# EasyEDA Pro project CH32V307_V3.0.0.eprj, board CH32V307
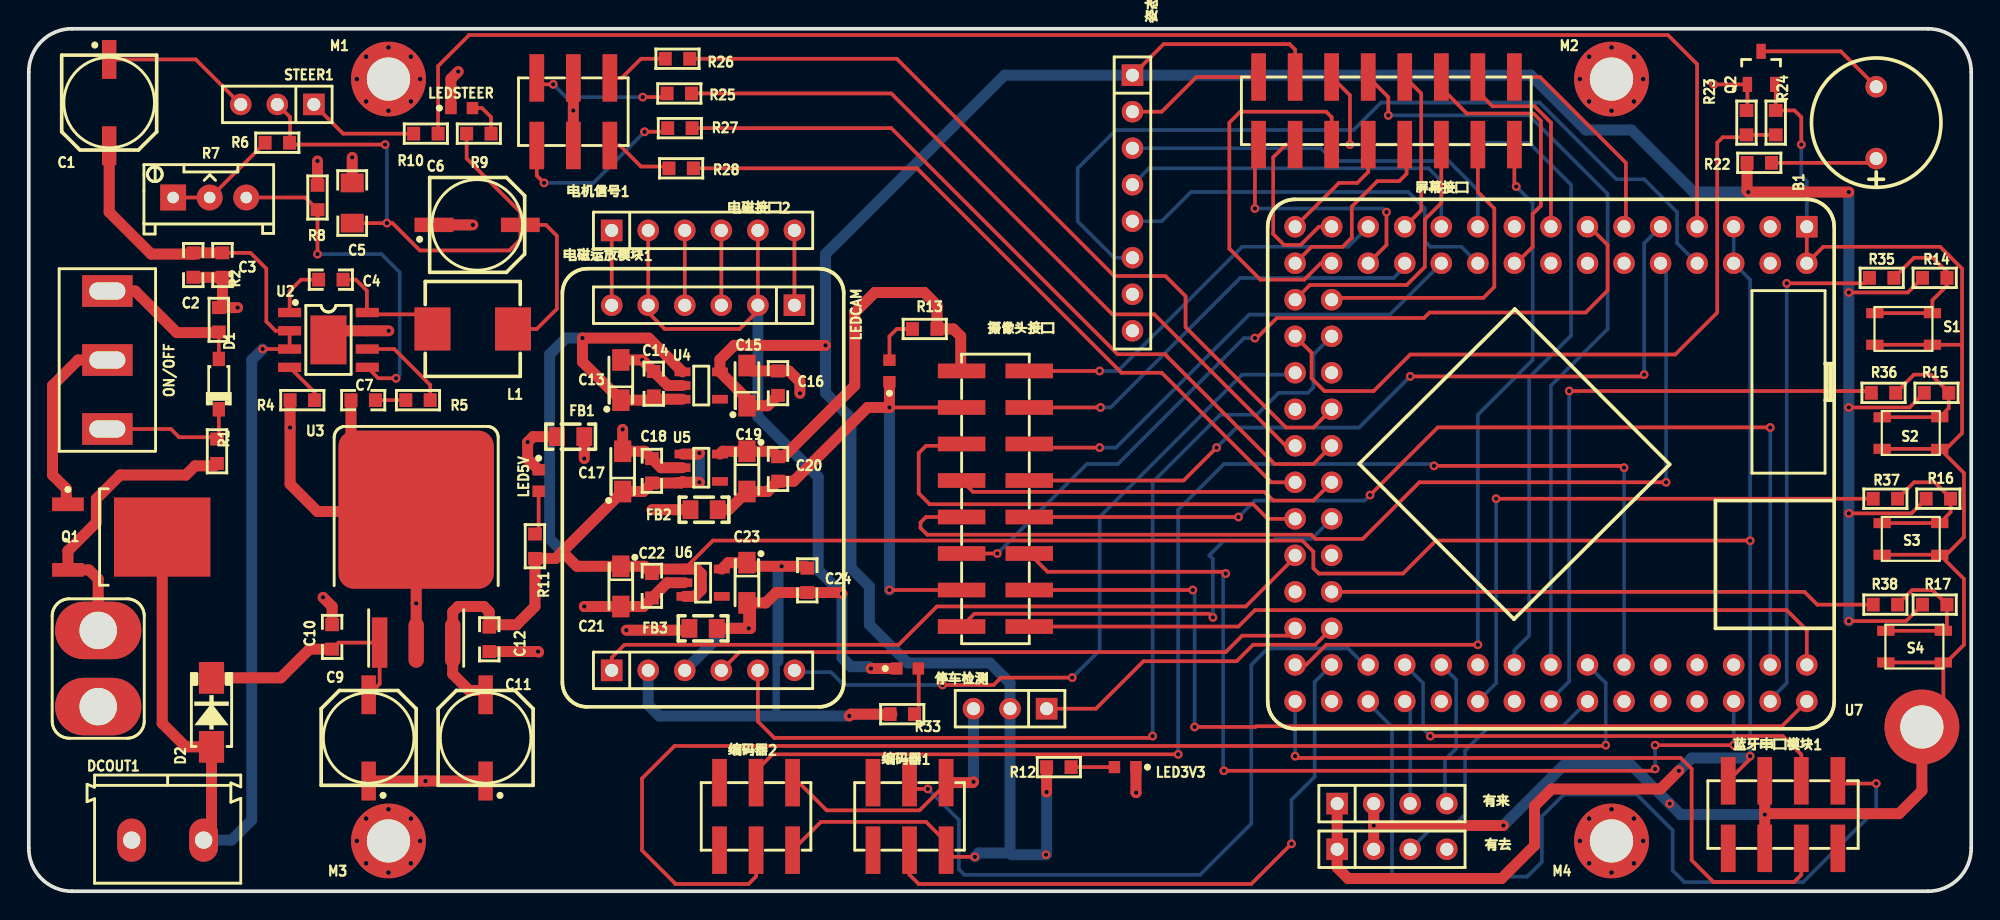
[diagram p1: board, top side]
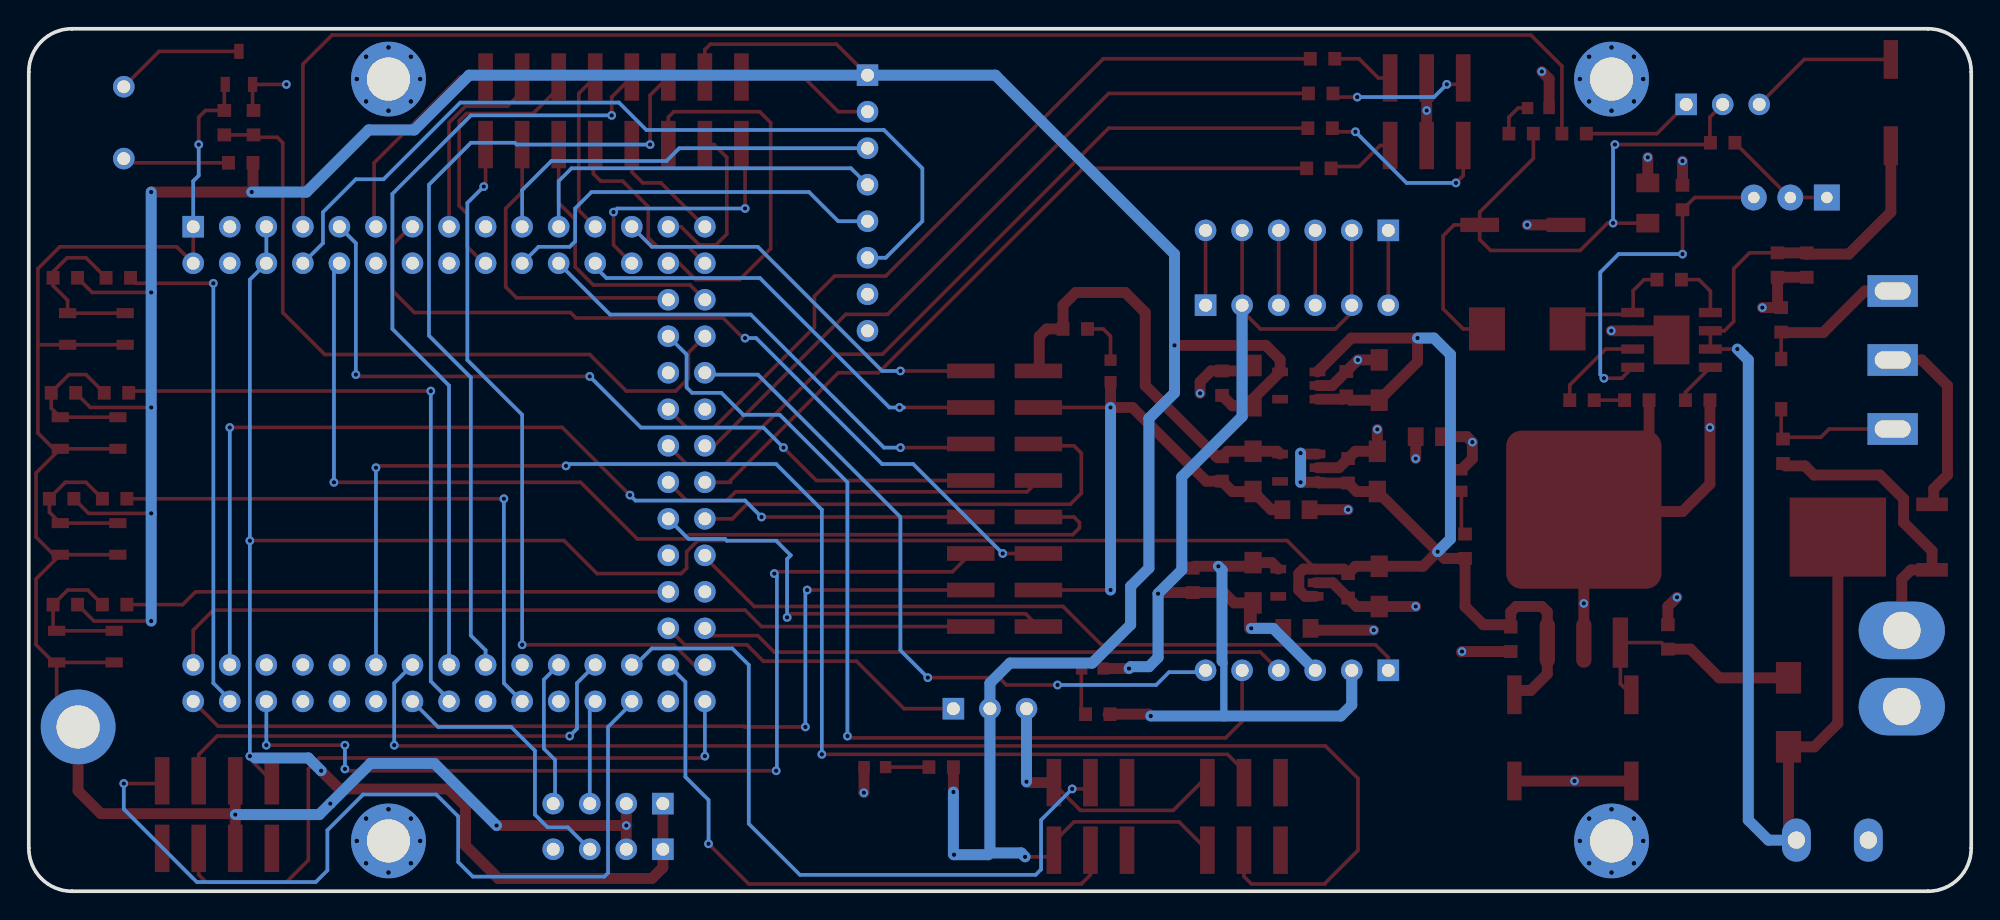
[diagram p2: board, bottom side, seen from below]

Outline 135 x 60 mm; copper layers: Top Layer, Bottom Layer. Coordinates in mm from the lower left corner of the outline.
Outline path: 0,57 0,3 arc(0.88,0.88) 3,0 132,0 arc(134.12,0.88) 135,3 135,57 arc(134.12,59.12) 132,60 3,60 arc(0.88,59.12) 0,57
Stack: Top Layer 0.035mm / Dielectric1 1.51mm FR4 er 4.5 / Bottom Layer 0.035mm

## Design rules (mm)
spacing safeClearance (default): track to track 0.152, other pairs 0.152 to 0.3
track width trackWidth (default): min 0.127, default 0.254, max 2.54
differential pair differentialPair (default): width min 0.127, default 0.254, max 2.54; gap min 0.152, default 0.152
via viaSize (default): diameter min 0.5, default 0.61, max 10; hole min 0.3, default 0.305, max 6

## Placement (name value [footprint] x y rotation side)
B1  BEEP  [BEEP 9x5.5mm]  128.4 53.47 90 top
C1  220uF  [CAPS6.3]  5.59 54.86 90 top
C2  4.7nF  [CAPC1608[0603]S-N]  11.43 43.56 270 top
C3  100nF  [CAPC1608[0603]S-N]  13.46 43.56 270 top
C4  100nF  [CAPC1608[0603]S-N]  20.99 42.55 0 top
C5  47uF  [CAPC3216[1206]S]  22.48 47.88 90 top
C6  220uF  [CAPS6.3]  31.16 46.36 180 top
C7  4.7nF  [CAPC1608[0603]S-N]  23.24 34.16 180 top
C9  100uF  [CAPS6.3]  23.62 10.67 270 top
C10  100nF  [CAPC1608[0603]S-N]  21.08 17.69 90 top
C11  220uF  [CAPS6.3]  31.75 10.67 270 top
C12  100nF  [CAPC1608[0603]S-N]  32 17.53 270 top
C13  10uF  [CAPT3216]  41.15 35.56 90 top
C14  100nF  [CAPC1608[0603]S-N]  43.43 35.31 90 top
C15  10uF  [CAPT3216]  49.91 35.18 90 top
C16  100nF  [CAPC1608[0603]S-N]  52.07 35.34 90 top
C17  10uF  [CAPT3216]  41.28 29.21 90 top
C18  100nF  [CAPC1608[0603]S-N]  43.31 29.25 90 top
C19  10uF  [CAPT3216]  49.91 29.21 270 top
C20  100nF  [CAPC1608[0603]S-N]  52.07 29.38 270 top
C21  10uF  [CAPT3216]  41.15 21.21 270 top
C22  100nF  [CAPC1608[0603]S-N]  43.31 21.25 270 top
C23  10uF  [CAPT3216]  49.91 21.46 270 top
C24  100nF  [CAPC1608[0603]S-N]  54.1 21.63 270 top
D1  BZT52C16  [SOD-123-L]  13.21 35.28 270 top
D2  SS54  [SMA[DO-214AC]]  12.7 12.45 90 top
DCOUT1  KF/WJ/DG 30x connecter  [KF/WJ/DG 301-2p-5.0mm]  9.65 3.56 0 top
FB1  0R  [INDC2012[0805]S]  37.66 31.62 0 top
FB2  0R  [INDC2012[0805]S]  46.93 26.54 0 top
FB3  0R  [INDC2012[0805]S]  46.86 18.29 0 top
L1  4.7uH  [0630 TPC 7*7*3]  30.86 39.12 0 top
LED3V3  翠绿贴片LED  [LEDC1608(0603)]  76.2 8.64 180 top
LED5V  翠绿贴片LED  [LEDC1608(0603)]  35.43 28.58 270 top
LEDCAM  翠绿贴片LED  [LEDC1608(0603)]  59.82 36.19 90 top
LEDOP  翠绿贴片LED  [LEDC1608(0603)]  61.07 15.49 0 top
LEDSTEER  翠绿贴片LED  [LEDC1608(0603)]  30.09 54.48 0 top
M1  MountHole  [M3-MountHole-Plated]  25 56.5 0 top
M2  MountHole  [M3-MountHole-Plated]  110 56.5 0 top
M3  MountHole  [M3-MountHole-Plated]  25 3.5 0 top
M4  MountHole  [M3-MountHole-Plated]  110 3.5 0 top
NOREF  -  [Pad_e1205]  131.57 11.43 0 top
ON/OFF  SW-SPDT  [SS12D10]  5.46 36.96 90 top
Q1  HY19P03  [TO-252AA]  6 24.64 0 top
Q2  S8050  [SOT-23]  120.4 57.28 90 top
R1  4.7K  [RESC1608[0603]S-N]  13.08 30.61 90 top
R2  1K  [RESC1608[0603]S-N]  13.21 39.75 270 top
R4  200K  [RESC1608[0603]S-N]  19.01 34.16 180 top
R5  20K  [RESC1608[0603]S-N]  27.05 34.16 180 top
R6  15K  [RESC1608[0603]S-N]  17.27 52.07 180 top
R7  10K  [RESPOT3296]  12.57 48.26 0 top
R8  3.3K  [RESC1608[0603]S-N]  20.07 48.26 90 top
R9  10K  [RESC1608[0603]S-N]  31.28 52.7 180 top
R10  1K  [RESC1608[0603]S-N]  27.6 52.7 0 top
R11  4.7K  [RESC1608[0603]S-N]  35.18 24 90 top
R12  2.7K  [RESC1608[0603]S-N]  71.59 8.64 0 top
R13  2.7K  [RESC1608[0603]S-N]  62.27 39.12 180 top
R14  4.7K(DNP)  [RESC1608[0603]S-N]  132.46 42.67 0 top
R15  4.7K(DNP)  [RESC1608[0603]S-N]  132.59 34.67 0 top
R16  4.7K(DNP)  [RESC1608[0603]S-N]  132.72 27.3 0 top
R17  4.7K(DNP)  [RESC1608[0603]S-N]  132.46 19.94 0 top
R22  10R  [RESC1608[0603]S-N]  120.27 50.67 0 top
R23  4.7K  [RESC1608[0603]S-N]  119.38 53.47 90 top
R24  10K  [RESC1608[0603]S-N]  121.41 53.47 90 top
R25  100R  [RESC1608[0603]S-N]  45.21 55.5 0 top
R26  100R  [RESC1608[0603]S-N]  45.09 57.91 0 top
R27  100R  [RESC1608[0603]S-N]  45.25 53.09 0 top
R28  100R  [RESC1608[0603]S-N]  45.34 50.29 0 top
R33  2.7K  [RESC1608[0603]S-N]  60.71 12.32 0 top
R35  470R  [RESC1608[0603]S-N]  128.78 42.67 180 top
R36  470R  [RESC1608[0603]S-N]  128.91 34.67 180 top
R37  470R  [RESC1608[0603]S-N]  129.03 27.3 180 top
R38  470R  [RESC1608[0603]S-N]  129.03 19.94 180 top
S1  Button  [PTS810-3*4-CurvePin]  130.3 39.12 0 top
S2  Button  [PTS810-3*4-CurvePin]  130.81 31.88 0 top
S3  Button  [PTS810-3*4-CurvePin]  130.81 24.51 0 top
S4  Button  [PTS810-3*4-CurvePin]  131.06 17.02 0 top
STEER1  Header 3  [HDR1X3]  19.81 54.74 180 top
U1  T型插头  [Wired T-Header ThroughHole]  4.83 15.49 0 top
U2  SCT2450  [SOP-8E]  20.83 38.35 0 top
U3  SPX2940-5.0  [TO-263-3]  26.92 21.92 0 top
U4  RT9013-33  [SOT-23-5]  46.74 35.18 0 top
U5  RT9013-33  [SOT-23-5]  46.74 29.46 0 top
U6  RT9013-33  [SOT-23-5]  46.86 21.46 0 top
U7  -  [CH32V307VxT6_CoreBoard]  123.57 46.23 180 top
停车检测  Header 3  [HDR1X3]  70.74 12.7 180 top
姿态传感器  Header 8  [HDR1X8]  76.71 56.77 270 top
屏幕接口  Header 8X2  [HDR2X8-M-SMT]  94.36 54.29 0 top
摄像头接口  Header 8X2  [HDR2X8-M-SMT]  67.18 27.3 90 top
有去  Header 4  [HDR1X4]  90.93 2.92 0 top
有来  Header 4  [HDR1X4]  90.93 6.1 0 top
电机信号1  Header 3X2  [HDR2X3-M-SMT]  37.85 54.23 180 top
电磁接口2  Header 6  [HDR1X6]  40.51 45.97 0 top
电磁运放模块1  OPA_MOD  [SEEKFREE_4CHANEL_OPAMOD]  46.86 28.07 0 top
编码器1  Header 3X2  [HDR2X3-M-SMT]  61.21 5.21 180 top
编码器2  Header 3X2  [HDR2X3-M-SMT]  50.55 5.21 180 top
蓝牙串口模块1  Header 4X2  [Female-Header-2.54-SMD-8]  121.92 5.33 270 top

## Footprints (pads in the part's own frame, mm; a bottom-side part is the same pattern mirrored in y, then rotated)
0630 TPC 7*7*3
  rect 2.5x3 smd: 1(-2.8,0) 2(2.8,0)
BEEP 9x5.5mm
  round 1.5 hole 0.9: 1(-2.5,0) 2(2.5,0)
CAPC1608[0603]S-N
  rect 0.9x0.95 smd: 1(-0.85,0) 2(0.85,0)
CAPC3216[1206]S
  rect 1.3x1.6 smd: 1(-1.4,0) 2(1.4,0)
CAPS6.3
  rect 2.7x1 smd: 1(-3,0) 2(3,0)
CAPT3216
  rect 1.5x1.2 smd: 1(-1.4,0) 2(1.4,0)
CH32V307VxT6_CoreBoard
  rect 1.5x1.5 hole 0.9: 1(0,0)
  round 1.5 hole 0.9: 2(0,2.54) 3(2.54,0) 4(2.54,2.54) 5(5.08,0) 6(5.08,2.54) 7(7.62,0) 8(7.62,2.54) 9(10.16,0) 10(10.16,2.54) 11(12.7,0) 12(12.7,2.54) 13(15.24,0) 14(15.24,2.54) 15(17.78,0) 16(17.78,2.54) 17(20.32,0) 18(20.32,2.54) 19(22.86,0) 20(22.86,2.54) 21(25.4,0) 22(25.4,2.54) 23(27.94,0) 24(27.94,2.54) 25(30.48,0) 26(30.48,2.54) 27(33.02,0) 28(33.02,2.54) 29(35.56,0) 30(35.56,2.54) 31(35.56,5.08) 32(33.02,5.08) 33(35.56,7.62) 34(33.02,7.62) 35(35.56,10.16) 36(33.02,10.16) 37(35.56,12.7) 38(33.02,12.7) 39(35.56,15.24) 40(33.02,15.24) 41(35.56,17.78) 42(33.02,17.78) 43(35.56,20.32) 44(33.02,20.32) 45(35.56,22.86) 46(33.02,22.86) 47(35.56,25.4) 48(33.02,25.4) 49(35.56,27.94) 50(33.02,27.94) 51(35.56,33.02) 52(35.56,30.48) 53(33.02,33.02) 54(33.02,30.48) 55(30.48,33.02) 56(30.48,30.48) 57(27.94,33.02) 58(27.94,30.48) 59(25.4,33.02) 60(25.4,30.48) 61(22.86,33.02) 62(22.86,30.48) 63(20.32,33.02) 64(20.32,30.48) 65(17.78,33.02) 66(17.78,30.48) 67(15.24,33.02) 68(15.24,30.48) 69(12.7,33.02) 70(12.7,30.48) 71(10.16,33.02) 72(10.16,30.48) 73(7.62,33.02) 74(7.62,30.48) 75(5.08,33.02) 76(5.08,30.48) 77(2.54,33.02) 78(2.54,30.48) 79(0,33.02) 80(0,30.48)
Female-Header-2.54-SMD-8
  rect 3.3x1.02 smd: 1(-2.35,3.81) 2(2.35,3.81) 3(-2.35,1.27) 4(2.35,1.27) 5(-2.35,-1.27) 6(2.35,-1.27) 7(-2.35,-3.81) 8(2.35,-3.81)
HDR1X3
  rect 1.5x1.5 hole 0.9: 1(0,0)
  round 1.5 hole 0.9: 2(2.54,0) 3(5.08,0)
HDR1X4
  rect 1.5x1.5 hole 0.9: 1(0,0)
  round 1.5 hole 0.9: 2(2.54,0) 3(5.08,0) 4(7.62,0)
HDR1X6
  rect 1.5x1.5 hole 0.9: 1(0,0)
  round 1.5 hole 0.9: 2(2.54,0) 3(5.08,0) 4(7.62,0) 5(10.16,0) 6(12.7,0)
HDR1X8
  rect 1.5x1.5 hole 0.9: 1(0,0)
  round 1.5 hole 0.9: 2(2.54,0) 3(5.08,0) 4(7.62,0) 5(10.16,0) 6(12.7,0) 7(15.24,0) 8(17.78,0)
HDR2X3-M-SMT
  rect 1.02x3.3 smd: 1(-2.54,-2.35) 2(-2.54,2.35) 3(0,-2.35) 4(0,2.35) 5(2.54,-2.35) 6(2.54,2.35)
HDR2X8-M-SMT
  rect 1.02x3.3 smd: 1(-8.89,-2.35) 2(-8.89,2.35) 3(-6.35,-2.35) 4(-6.35,2.35) 5(-3.81,-2.35) 6(-3.81,2.35) 7(-1.27,-2.35) 8(-1.27,2.35) 9(1.27,-2.35) 10(1.27,2.35) 11(3.81,-2.35) 12(3.81,2.35) 13(6.35,-2.35) 14(6.35,2.35) 15(8.89,-2.35) 16(8.89,2.35)
INDC2012[0805]S
  rect 1.1x1.3 smd: 1(-0.948,0) 2(0.948,0)
KF/WJ/DG 301-2p-5.0mm
  oval 2x3 hole 1.2: 1(2.5,0) 2(-2.5,0)
LEDC1608(0603)
  rect 0.8x0.85 smd: A(0.75,0) C(-0.75,0)
M3-MountHole-Plated
  round 5.2 hole 3: 1(0,0)
Pad_e1205
  round 5.2 hole 3: 1(0,0)
PTS810-3*4-CurvePin
  rect 1.2x0.7 smd: 1(-2,-1.1) 1(2,-1.1) 2(-2,1.1) 2(2,1.1)
RESC1608[0603]S-N
  rect 0.9x0.95 smd: 1(-0.85,0) 2(0.85,0)
RESPOT3296
  rect 1.8x1.8 hole 0.8: 1(-2.54,0)
  round 1.8 hole 0.8: 2(2.54,0) ADJ(0,0)
SEEKFREE_4CHANEL_OPAMOD
  rect 1.5x1.5 hole 0.9: 1(6.35,12.7) 7(-6.35,-12.7)
  round 1.5 hole 0.9: 2(3.81,12.7) 3(1.27,12.7) 4(-1.27,12.7) 5(-3.81,12.7) 6(-6.35,12.7) 8(-3.81,-12.7) 9(-1.27,-12.7) 10(1.27,-12.7) 11(3.81,-12.7) 12(6.35,-12.7)
SMA[DO-214AC]
  rect 2.2x1.75 smd: A(-2.4,0) K(2.4,0)
SOD-123-L
  rect 1x0.85 smd: A(-1.75,0) K(1.75,0)
SOP-8E
  rect 2.5x3.4 smd: 0(0,0)
  rect 1.6x0.65 smd: 1(-2.7,1.905) 2(-2.7,0.635) 3(-2.7,-0.635) 4(-2.7,-1.905) 5(2.7,-1.905) 6(2.7,-0.635) 7(2.7,0.635) 8(2.7,1.905)
SOT-23
  rect 1.05x0.65 smd: 1(-1.15,0.95) 2(-1.15,-0.95) 3(1.15,0)
SOT-23-5
  rect 1.1x0.6 smd: 1(-1.3,0.95) 2(-1.3,0) 3(-1.3,-0.95) 4(1.3,-0.95) 5(1.3,0.95)
SS12D10
  rect 2.2x3.5 hole 1.2x2.5: 1(-4.8,0) 2(0,0) 3(4.8,0)
TO-252AA
  rect 6.7x5.5 smd: 1(3.275,0)
  rect 2.2x0.95 smd: 2(-3.275,2.28) 3(-3.275,-2.28)
TO-263-3
  rect 1.07x3.5 smd: 1(-2.54,-4.623)
  rrect 10.8x11 smd: 2(0,4.623)
  rrect 1.07x3.5 smd: 2(0,-4.623) 3(2.54,-4.623)
Wired T-Header ThroughHole
  rrect 6x4 hole 2.6: 1(0,2.65) 2(0,-2.65)

## Nets
As in the schematic, except:
GND5V: C13.2 C14.2 C15.2 C16.2 C17.2 C18.2 C21.2 C22.2 FB1.2 FB2.1 FB3.1 LED3V3.C NOREF.1 Q2.2 R24.2 S1.1 S2.1 S3.1 S4.1 U4.2 U5.2 U6.2 U7.1 U7.2 停车检测.3 姿态传感器.2 屏幕接口.2 有去.2 有来.2 编码器1.1 编码器2.1 蓝牙串口模块1.5 蓝牙串口模块1.6

Pads without a net: M1 1; M2 1; M3 1; M4 1; U4 4; U5 4; U6 4; U7 3 4 12 14 16 17 36 37 46 47 53 59 62 63 69 71 72 73 74 76; 姿态传感器 7 8; 有去 4; 编码器1 5 6; 编码器2 5 6; 蓝牙串口模块1 2 8

## Via types
v1: diameter 0.61, hole 0.305, Top Layer to Bottom Layer, 166 vias

## Routing (per net, layer and track width the routed paths; a pad name or vN(x,y) marks a point on that pad's centre or on a via; arc(x,y) is an arc through that point)
GND5V: length 198.2
  Top Layer w0.254: S2.1 133.27,30.78 134.37,31.88 134.37,38.02 ; S2.1 134.49,29.09 134.49,24.64 133.27,23.41 S3.1 ; S2.1 S2.1 ; 134.37,38.02 S1.1 S1.1 ; 134.37,38.02 134.37,43.31 132.84,44.83 124.71,44.83 U7.2 U7.1 ; Q2.2 121.41,56.06 R24.2 122.72,54.32 123.19,53.85 v1(123.19,51.94) ; S3.1 S3.1 ; S3.1 134.49,21.73 134.49,17.14 133.27,15.92 S4.1 ; 屏幕接口.2 81.15,56.64 78.74,54.23 姿态传感器.2 ; 编码器1.1 63.75,7.47 61.91,5.63 55.46,5.63 53.53,7.56 编码器2.1 ; S4.1 S4.1 ; S4.1 133.06,12.92 NOREF.1 131.57,10.7
  Top Layer w0.762: FB1.2 v1(38.61,30.1) ; 49.91,36.58 50.29,36.19 C16.2 52.83,36.19 53.59,35.43 v1(53.59,34.64) ; 蓝牙串口模块1.6 v1(120.65,5.33) 120.65,5.4 ; U6.2 44.37,21.46 C22.2 42.72,19.81 C21.2 38.61,19.81 v1(38.61,19.81) ; 41.15,36.96 v1(42.63,36.96) C14.2 44.41,35.18 U4.2 ; 120.65,5.4 129.98,5.4 131.57,6.98 131.57,10.7 ; 120.65,5.4 蓝牙串口模块1.5 ; v1(93.47,4.57) v1(102.49,4.57) ; v1(93.47,4.57) 有去.2 ; v1(93.47,4.57) 有来.2 ; FB3.1 45.79,18.16 v1(41.53,18.16) ; LED3V3.C 76.95,6.87 v1(76.96,6.86) ; 编码器1.1 65.6,7.56 v1(65.66,7.62) ; v1(43.31,26.54) FB2.1 ; v1(41.28,32.13) C17.2 42.8,30.61 C18.2 43.94,29.46 U5.2
  Bottom Layer w0.254: v1(123.19,51.94) 123.19,49.78 123.57,49.4 U7.1
  Bottom Layer w0.762: v1(65.66,7.62) 停车检测.3 ; v1(120.65,5.33) 114.81,5.33 v1(114.05,6.1) 111.25,8.89 106.81,8.89 v1(102.49,4.57)
GNDBAT: length 86.4
  Top Layer w0.254: STEER1.3 11.61,57.86 C1.2
  Top Layer w0.762: 21.08,18.54 21.08,19.81 v1(20.45,20.45) ; 电机信号1.4 v1(37.85,54.31) 电机信号1.3 ; v1(25.02,38.99) U2.7 21.46,38.99 U2.0 ; v1(30.86,46.36) C6.2 ; C7.2 22.39,31.08 U3.2 ; 13.4,40.6 13.46,40.67 C3.2 C2.2 ; 13.4,40.6 R2.1 ; 13.4,40.6 v1(14.52,40.6) ; LED5V.C 34.67,30.09 v1(34.67,31.24) 35.05,31.62 FB1.1 ; U3.2 26.8,26.42 20.07,26.42 18.16,28.32 v1(18.16,32.26) R4.2 ; U3.2 v1(26.92,20.03) U3.2 ; C12.2 v1(35.39,16.68) 35.43,16.64 ; R8.2 v1(20.07,50.8) ; C11.2 v1(27.57,7.67) C9.2 ; v1(29.84,57.02) 29.34,56.52 LEDSTEER.C ; v1(22.48,51.05) 22.48,49.28
GNDCAM: length 39.4
  Top Layer w0.254: v1(59.82,33.66) 摄像头接口.14 ; v1(59.82,20.95) 摄像头接口.4
  Top Layer w0.762: LEDCAM.C v1(59.82,33.66) 58.29,33.66 53.16,28.53 C20.2 51.35,27.81 C19.2 48.65,26.54 FB2.2
  Bottom Layer w0.762: v1(59.82,20.95) v1(59.82,33.66)
GNDOP: length 69.4
  Top Layer w0.254: 电磁接口2.5 50.67,40.26 50.55,40.26 49.4,39.12 44.2,39.12 43.05,40.26 电磁接口2.2
  Top Layer w0.762: 50.16,19.81 50.16,18.29 v1(50.04,18.29) ; 50.16,19.81 50.04,19.68 v1(50.04,18.29) ; 50.16,19.81 C23.2 51.22,20.06 51.94,20.78 C24.2 56.44,20.78 v1(56.51,20.7) ; v1(58.53,15.49) LEDOP.C ; v1(50.04,18.29) FB3.2
  Bottom Layer w0.762: 电磁运放模块1.9 48.51,18.29 v1(50.04,18.29) ; 电磁运放模块1.2 50.67,33.02 54.86,28.83 54.86,22.35 v1(56.51,20.7) 56.51,16.26 57.15,15.62 58.41,15.62 v1(58.53,15.49)
VCC3V3: length 239
  Top Layer w0.254: 131.61,19.94 130.47,18.8 v1(126.49,18.8) ; 编码器2.2 55.06,4.83 62.36,4.83 63.75,3.43 编码器1.2 64.22,2.4 v1(65.76,2.4) ; R15.1 130.72,33.66 v1(126.49,33.66) ; v1(126.49,26.29) 130.85,26.29 R16.1 ; v1(126.49,41.66) 130.59,41.66 131.61,42.67 ; 姿态传感器.1 78.87,58.93 87.63,58.93 88.01,58.55 屏幕接口.4
  Top Layer w0.762: v1(126.49,48.64) v1(119.51,48.64) 119.42,48.73 R22.1 ; v1(70.74,6.9) R12.1 ; v1(55.37,37.97) 49.02,37.97 48.04,36.99 U4.5 49.91,34.25 C15.1 51.35,33.78 C16.1
  Bottom Layer w0.762: v1(126.49,48.64) v1(126.49,41.66) v1(126.49,33.66) v1(126.49,26.29) v1(126.49,18.8) ; v1(65.76,2.4) 66.03,2.67 68.2,2.67 ; v1(119.51,48.64) 115.7,48.64 111.38,52.96 108.2,52.96 104.39,56.77 姿态传感器.1 67.82,56.77 55.37,44.32 v1(55.37,37.97) 55.37,34.67 57.15,32.89 57.15,22.48 58.42,21.21 58.42,18.54 61.09,15.88 66.8,15.88 68.2,14.48 停车检测.2 68.2,2.67 ; v1(70.74,6.9) 70.74,2.58 v1(70.7,2.54) 68.33,2.54 68.2,2.67
VCC5V: length 238.2
  Top Layer w0.254: 蓝牙串口模块1.7 119.63,9.21 v1(119.63,9.4) ; v1(119.63,24.38) 119.62,24.4 97.8,24.4 95.5,22.1 89.66,22.1 89.28,22.48 89.28,23.62 88.51,24.4 47.55,24.4 U6.1
  Top Layer w0.762: C11.1 31.45,13.97 30.61,13.97 29.46,15.11 U3.3 29.46,19.43 29.84,19.81 31.62,19.81 32,19.43 C12.1 32.17,18.54 33.91,18.54 35.18,19.81 R11.1 36.61,23.15 v1(37.08,23.62) ; 45.37,28.45 45.32,28.4 C18.1 42.72,27.81 C17.1 v1(37.08,23.62) ; 45.37,28.45 U5.3 ; 45.37,28.45 v1(46.61,28.45) ; v1(46.61,30.48) 46.54,30.41 U5.1 ; 有来.1 有去.1 90.93,1.65 91.69,0.89 102.36,0.89 104.65,3.18 104.65,5.92 105.84,7.11 113.41,7.11 v1(114.68,8.38) ; U4.3 43.66,34.23 C14.1 43.14,34.16 C13.1 38.48,36.83 v1(38.48,38.48) 43.08,38.48 U4.1 ; v1(37.08,23.62) 38.1,22.61 C21.1 42.8,22.61 C22.1 43.62,22.41 U6.1 46.42,22.41 46.74,22.09 46.74,20.95 46.29,20.51 U6.3
  Bottom Layer w0.254: U7.5 U7.6 119.63,42.55 v1(119.63,24.38) v1(119.63,9.4)
  Bottom Layer w0.762: v1(37.08,23.62) 36.19,24.51 36.19,37.34 37.34,38.48 v1(38.48,38.48) ; v1(46.61,30.48) v1(46.61,28.45) ; 119.25,9.27 115.57,9.27 v1(114.68,8.38)
VCCBAT: length 86.9
  Top Layer w0.254: C3.1 15.41,44.41 16.51,43.31 16.51,39.63 17.15,38.99 U2.2 U2.3 v1(16.26,37.72)
  Top Layer w0.762: C2.1 11.58,44.41 ; 11.58,44.41 11.5,44.32 8.51,44.32 5.59,47.24 C1.1 ; 11.58,44.41 C3.1 ; Q1.1 9.27,11.68 10.91,10.05 D2.A 12.7,4.1 DCOUT1.1
  Bottom Layer w0.762: v1(16.26,37.72) 15.49,36.96 15.49,4.95 14.1,3.56 DCOUT1.1
VCCCAM: length 29.4
  Top Layer w0.762: 摄像头接口.16 64.77,36.26 64.77,38.61 64.26,39.12 R13.1 63.12,40.77 62.23,41.66 58.8,41.66 57.4,40.26 57.4,35.18 52.45,30.23 C20.1 51.69,30.61 C19.1 48.23,30.61 U5.5
VCCOP: length 36.6
  Top Layer w0.762: 59.98,12.32 57.15,12.32 v1(57.02,12.19) ; U6.5 48.61,22.86 C23.1 50.16,22.61 v1(52.32,22.61) 53.97,22.61 C24.1
  Bottom Layer w0.508: 51.94,12.19 51.94,15.88 52.07,16
  Bottom Layer w0.762: v1(52.32,22.61) 52.07,22.35 52.07,16 ; v1(57.02,12.19) 43.81,12.19 43.05,12.95 电磁运放模块1.8
VCCSTEER: length 48.5
  Top Layer w0.254: 30.43,52.7 30.43,50.98 34.16,47.24 C6.1 ; C6.1 35.94,46.36 36.7,45.59 36.7,40.51 35.31,39.12 L1.2 ; C6.1 34.16,45.34 33.4,44.58 27.18,44.58 25.27,46.48 v1(24.89,46.48) 24.89,46.48 C5.1 ; STEER1.2 18.16,53.85 18.16,52.11 R6.1 18.25,51.94 v1(24.77,51.94)
  Bottom Layer w0.254: v1(24.77,51.94) 24.89,51.82 v1(24.89,46.48)
(no net):
  vias: v1(22.8,56.5) v1(22.8,56.5) v1(22.8,3.5) v1(22.8,3.5) v1(23.44,58.06) v1(23.44,58.06) v1(23.44,54.94) v1(23.44,54.94) v1(23.44,5.06) v1(23.44,5.06) v1(23.44,1.94) v1(23.44,1.94) v1(25,58.7) v1(25,58.7) v1(25,54.3) v1(25,54.3) v1(25,5.7) v1(25,5.7) v1(25,1.3) v1(25,1.3) v1(26.56,58.06) v1(26.56,58.06) v1(26.56,54.94) v1(26.56,54.94) v1(26.56,5.06) v1(26.56,5.06) v1(26.56,1.94) v1(26.56,1.94) v1(27.2,56.5) v1(27.2,56.5) v1(27.2,3.5) v1(27.2,3.5) v1(107.8,56.5) v1(107.8,56.5) v1(107.8,3.5) v1(107.8,3.5) v1(108.44,58.06) v1(108.44,58.06) v1(108.44,54.94) v1(108.44,54.94) v1(108.44,5.06) v1(108.44,5.06) v1(108.44,1.94) v1(108.44,1.94) v1(110,58.7) v1(110,58.7) v1(110,54.3) v1(110,54.3) v1(110,5.7) v1(110,5.7) v1(110,1.3) v1(110,1.3) v1(111.56,58.06) v1(111.56,58.06) v1(111.56,54.94) v1(111.56,54.94) v1(111.56,5.06) v1(111.56,5.06) v1(111.56,1.94) v1(111.56,1.94) v1(112.2,56.5) v1(112.2,56.5) v1(112.2,3.5) v1(112.2,3.5)
A0: length 57
  Top Layer w0.254: U7.38 89.28,32.26 87.38,32.26 80.4,39.24 80.4,41.39 78.99,42.8 75.44,42.8 60.32,57.91 R26.2
A1: length 52.1
  Top Layer w0.254: R25.2 59.94,55.5 75.31,40.13 78.22,40.13 87.36,30.99 U7.39
A2: length 54.7
  Top Layer w0.254: R27.2 59.94,53.09 75.67,37.36 78.97,37.36 79.12,37.21 79.12,37.19 86.59,29.72 89.28,29.72 U7.40
A3: length 50.9
  Top Layer w0.254: U7.41 86.23,28.45 86.23,28.58 78.74,36.07 75.95,36.07 61.72,50.29 R28.2
A4: length 26.8
  Top Layer w0.254: 摄像头接口.10 65.62,27.79 85.88,27.79 86.49,27.18 89.28,27.18 U7.42
A5: length 32.9
  Top Layer w0.254: 摄像头接口.12 64.71,30.99 62.36,30.99 61.85,30.48 61.85,27.69 62.61,26.92 85.09,26.92 86.11,25.91 U7.43
A6: length 31.9
  Top Layer w0.254: v1(82.3,19.05) 82.04,19.3 65.72,19.3 摄像头接口.2
  Bottom Layer w0.254: v1(82.3,19.05) 82.3,23.11 82.04,23.37 83.06,24.38 86.49,24.38 86.61,24.51 89.15,24.51 U7.44
A7: length 51.4
  Top Layer w0.254: 电磁运放模块1.7 40.51,16.26 41.4,17.14 60.45,17.14 63.12,19.81 84.58,19.81 88.01,23.24 U7.45
A8: length 35.5
  Top Layer w0.254: R35.2 127.55,42.29 v1(122.17,42.29)
  Bottom Layer w0.254: U7.77 121.03,13.33 122.17,14.48 v1(122.17,42.29)
A9: length 57.5
  Top Layer w0.254: U7.80 123.57,18.16 122.17,19.56 85.22,19.56 84.07,18.41 摄像头接口.1
A10: length 64.2
  Top Layer w0.254: v1(81.03,11.43) 85.24,11.43 85.29,11.48 121.84,11.48 U7.79 ; v1(80.9,20.95) 摄像头接口.3
  Bottom Layer w0.254: v1(81.03,11.43) 81.03,20.83 v1(80.9,20.95)
A15: length 105.2
  Top Layer w0.254: U7.7 115.95,57.53 113.92,59.56 30.61,59.56 28.45,57.4 R10.2
B0: length 38
  Top Layer w0.254: R38.2 124.3,19.94 123.41,20.83 U7.48
B1: length 41.1
  Top Layer w0.254: 电磁运放模块1.10 49.4,16.64 83.19,16.64 84.33,17.78 87.5,17.78 U7.49
B2: length 22.1
  Top Layer w0.254: U7.50 89.41,17.14 85.09,17.14 83.95,16 77.47,16 74.17,12.7 停车检测.1
B3: length 27.8
  Bottom Layer w0.254: U7.19 100.71,48.77 98.68,50.8 90.68,50.8 89.79,51.69 姿态传感器.3
B4: length 28.2
  Bottom Layer w0.254: 姿态传感器.5 78.74,46.61 80.77,48.64 95.88,48.64 97.03,47.5 97.03,45.21 97.41,44.83 99.57,44.83 U7.20
B5: length 25.5
  Bottom Layer w0.254: 姿态传感器.4 77.85,50.29 97.28,50.29 98.17,49.4 U7.21
B6: length 34.1
  Top Layer w0.254: v1(74.42,30.86) 69.79,30.86 摄像头接口.11
  Bottom Layer w0.254: v1(74.42,30.86) 75.56,30.86 84.82,40.12 94.6,40.12 U7.22
B7: length 11.4
  Top Layer w0.254: 屏幕接口.10 96.77,55.5 96.77,47.37 U7.23
B8: length 30.7
  Top Layer w0.254: 74.42,33.66 摄像头接口.13
  Bottom Layer w0.254: 74.17,33.66 v1(74.49,33.66) 75.18,33.66 84.2,42.67 84.21,42.66 94.86,42.66 95.63,43.43 U7.24
B9: length 27.7
  Top Layer w0.254: 摄像头接口.15 v1(74.42,36.19)
  Bottom Layer w0.254: v1(74.42,36.19) 75.69,36.19 84.33,44.83 91.69,44.83 U7.25
B12: length 40.8
  Top Layer w0.254: v1(101.98,27.3) R37.2
  Bottom Layer w0.254: U7.61 101.98,14.48 v1(101.98,27.3)
B13: length 56.9
  Top Layer w0.254: v1(91.82,51.94) 91.82,55.37 屏幕接口.6
  Bottom Layer w0.254: U7.64 103.25,16.76 104.28,17.79 104.28,35.74 107.19,38.65 107.19,49.15 104.27,52.07 101.22,52.07 101.09,51.94 v1(91.82,51.94)
B15: length 55.1
  Top Layer w0.254: 屏幕接口.8 94.49,55.25 v1(94.49,53.97)
  Bottom Layer w0.254: U7.66 105.79,35.18 109.73,39.12 109.73,48.51 104.27,53.97 v1(94.49,53.97)
C0: length 67.2
  Top Layer w0.254: 电磁运放模块1.11 50.67,11.81 51.82,10.67 77.98,10.67 v1(78.1,10.8)
  Bottom Layer w0.254: v1(78.1,10.8) 78.1,28.45 82.8,33.15 85.36,33.15 85.36,33.16 86.87,34.67 88.9,34.67 89.28,35.05 89.28,37.34 U7.34
C1: length 49.6
  Top Layer w0.254: v1(63.5,14.35) 67.06,14.35 67.56,14.86 v1(72.52,14.86)
  Bottom Layer w0.254: 电磁运放模块1.12 53.34,15.24 55.75,15.24 56.64,14.35 v1(63.5,14.35) ; U7.35 87.88,35.94 84.33,35.94 74.42,26.03 74.42,16.76 v1(72.52,14.86)
C8: length 68.2
  Top Layer w0.254: v1(113.03,10.16) v1(118.49,10.16) ; v1(113.03,8.51) 112.9,8.38 v1(83.06,8.38) ; v1(83.19,22.1) 83.06,22.22 70.8,22.22 摄像头接口.5
  Bottom Layer w0.254: v1(118.49,10.16) U7.75 ; v1(83.06,8.38) 83.01,8.43 83.01,21.92 v1(83.19,22.1) ; v1(113.03,8.51) v1(113.03,10.16)
C9: length 70.6
  Top Layer w0.254: v1(84.07,26.03) 摄像头接口.7 ; v1(93.22,27.56) 97.93,32.27 121.02,32.27 v1(121.03,32.26)
  Bottom Layer w0.254: v1(121.03,32.26) U7.78 ; v1(84.07,26.03) 85.22,27.18 92.84,27.18 v1(93.22,27.56)
C10: length 59.4
  Bottom Layer w0.254: 姿态传感器.6 75.44,44.07 72.9,46.61 72.9,50.29 75.56,52.96 92.07,52.96 93.98,54.86 105.01,54.86 110.34,49.53 112.27,49.53 114.55,47.24 114.55,45.08 U7.8
C11: length 56.5
  Top Layer w0.254: v1(96.01,35.81) 112.14,35.81 v1(112.27,35.94) ; 摄像头接口.9 80.26,28.58 v1(82.55,30.86)
  Bottom Layer w0.254: v1(82.55,30.86) 83.95,32.26 92.46,32.26 v1(96.01,35.81) ; U7.9 112.27,45.08 v1(112.27,35.94)
C12: length 72.6
  Top Layer w0.254: v1(113.79,28.45) 96.65,28.45 92.71,24.51 89.42,24.51 89.13,24.8 62.44,24.8 61.98,25.27 61.98,25.65 62.36,26.03 摄像头接口.8
  Bottom Layer w0.254: U7.10 113.79,43.31 v1(113.79,28.45)
C13: length 50.3
  Top Layer w0.254: U7.33 89.15,37.47 89.15,35.69 90.04,34.8 93.47,34.8 96.01,37.34 114.43,37.34 117.35,40.26 117.35,52.07 117.73,52.45 119.21,52.45 R23.1 R24.1
D0: length 14.7
  Top Layer w0.254: 屏幕接口.16 105.03,56.64 111,50.67 111,46.36 U7.11
D2: length 57.7
  Top Layer w0.254: U7.13 108.46,46.23 109.73,44.96 109.73,41.78 108.2,40.26 97.35,40.26 96.97,39.88 86.74,39.88 85.34,38.48 v1(85.22,38.48) ; v1(67.31,23.5) 摄像头接口.6
  Bottom Layer w0.254: v1(67.31,23.5) 73.53,29.72 75.69,29.72 84.46,38.48 v1(85.22,38.48) 85.34,38.48
D4: length 14.2
  Top Layer w0.254: U7.15 105.79,53.47 104.65,54.61 101.73,54.61 100.71,55.63 屏幕接口.14
D7: length 19.4
  Top Layer w0.254: U7.18 103.38,43.69 104.52,44.83 104.52,47.12 105.09,47.69 105.09,53.59 104.58,54.1 99.95,54.1 98.17,55.88 屏幕接口.12
D8: length 43.2
  Top Layer w0.254: R36.2 127.93,34.8 v1(107.06,34.8)
  Bottom Layer w0.254: v1(107.06,34.8) 107.06,14.61 105.79,13.33 U7.65
D9: length 90
  Top Layer w0.254: v1(109.6,10.16) 109.55,10.11 44.88,10.11 42.62,7.85 42.62,2.84 44.92,0.54 44.92,0.51 50.03,0.51 50.55,1.03 编码器2.4
  Bottom Layer w0.254: v1(109.6,10.16) 109.6,14.48 U7.68
D10: length 19.2
  Bottom Layer w0.254: U7.67 106.55,11.43 101.47,11.43 99.82,9.78 99.82,5.33 98.93,4.44 97.54,4.44 有去.3
D11: length 93.8
  Top Layer w0.254: v1(79.88,9.53) 51.69,9.53 50.55,8.38 编码器2.3 ; v1(110.87,29.46) 110.74,29.59 v1(97.66,29.59)
  Bottom Layer w0.254: v1(110.87,29.46) U7.70 ; v1(79.88,9.53) 79.88,26.54 83.06,29.72 97.54,29.72 v1(97.66,29.59)
E0: length 17.9
  Top Layer w0.254: v1(94.36,47.24) 94.36,44.96 U7.26 ; 屏幕接口.1 85.22,51.69 v1(85.22,47.5)
  Bottom Layer w0.254: v1(94.36,47.24) 94.11,47.5 v1(85.22,47.5)
E1: length 12.1
  Top Layer w0.254: 屏幕接口.3 87.38,51.94 86.49,51.05 86.49,45.72 87.25,44.96 88.39,44.96 89.66,46.23 U7.27
E2: length 26.7
  Top Layer w0.254: 屏幕接口.5 90.55,53.85 90.17,54.23 84.2,54.23 83.44,53.47 83.44,44.7 85.6,42.55 88.65,42.55 89.79,43.69 U7.28
E3: length 8.6
  Top Layer w0.254: U7.29 91.06,49.28 92.33,49.28 93.09,50.04 屏幕接口.7
E4: length 13.7
  Top Layer w0.254: U7.30 89.15,44.83 91.31,44.83 91.95,45.47 91.95,47.62 93.72,49.4 95.25,49.4 95.76,49.91 95.76,51.82 屏幕接口.9
E5: length 18.9
  Top Layer w0.254: U7.31 89.04,42.18 95.77,42.18 97.03,43.43 97.03,46.74 98.17,47.88 屏幕接口.11
E6: length 22.1
  Top Layer w0.254: U7.32 90.68,41.28 101.09,41.28 101.85,42.04 101.85,47.5 100.71,48.64 屏幕接口.13
E7: length 50.2
  Top Layer w0.254: 屏幕接口.15 103.25,49.15 v1(103.38,49.02) ; U7.52 88.77,15.75 90.17,17.14 v1(100.71,17.14)
  Bottom Layer w0.254: v1(103.38,49.02) 104.52,47.88 104.52,36.96 100.71,33.15 v1(100.71,17.14)
E8: length 48.4
  Top Layer w0.254: v1(88.01,9.4) 88.14,9.27 114.81,9.27 115.57,8.51 115.57,2.16 117.09,0.63 122.68,0.63 123.19,1.14 蓝牙串口模块1.4
  Bottom Layer w0.254: v1(88.01,9.4) U7.51
E9: length 43.3
  Top Layer w0.254: 编码器1.4 61.21,1.14 61.85,0.51 84.96,0.51 v1(87.76,3.3)
  Bottom Layer w0.254: v1(87.76,3.3) 87.76,6.35 89.36,7.96 89.36,14.56 U7.54
E11: length 50
  Top Layer w0.254: 编码器1.3 61.65,7.12 v1(62.48,7.12)
  Bottom Layer w0.254: v1(62.48,7.12) 64.64,4.96 64.64,1.52 65.02,1.14 81.41,1.14 84.96,4.7 84.96,15.75 86.11,16.89 91.69,16.89 92.84,15.75 U7.56
E12: length 61.4
  Top Layer w0.254: 蓝牙串口模块1.1 125.92,7.49 v1(128.4,7.49)
  Bottom Layer w0.254: v1(128.4,7.49) 128.4,5.72 123.32,0.63 115.06,0.63 114.25,1.45 114.25,4.24 111.76,6.73 106.68,6.73 105.16,5.21 105.16,2.03 104.14,1.02 95,1.02 94.74,1.27 94.74,11.43 93.09,13.08 U7.55
E13: length 33.8
  Top Layer w0.254: v1(97.41,10.8) 121.91,10.8 123.19,9.51 蓝牙串口模块1.3
  Bottom Layer w0.254: v1(97.41,10.8) 96.9,11.3 96.9,14.48 U7.58
E14: length 7.3
  Bottom Layer w0.254: U7.57 96.01,12.83 有来.3
E15: length 10.5
  Bottom Layer w0.254: 有来.4 98.43,6.22 98.43,9.14 99.2,9.92 99.2,14.72 U7.60
$1N1646: length 21.1
  Top Layer w0.762: R1.1 12.92,29.59 11.56,29.59 10.92,28.96 6.35,28.96 4.7,27.3 4.7,25.65 2.72,23.68 2.72,22.36 2.73,22.35 4.19,22.35 4.83,21.72 U1.1
$1N1675: length 10.8
  Top Layer w0.254: R2.2 D1.A
  Top Layer w0.762: R2.2 13.17,38.86 10.29,38.86 7.39,41.76 ON/OFF.3
$1N1680: length 10.1
  Top Layer w0.254: 13.21,31.58 R1.2 ; 13.21,31.58 10.45,31.58 9.88,32.16 ON/OFF.1 ; 13.21,31.58 D1.K
$1N4031: length 3
  Top Layer w0.254: R12.2 LED3V3.A
$1N14893: length 3.5
  Top Layer w0.254: R13.2 60.32,39.12 59.82,38.61 LEDCAM.A
$1N15943: length 16.6
  Top Layer w0.254: C10.1 21.54,17.3 U3.1 24.38,14.43 C9.1
  Top Layer w0.762: C10.1 19.51,16.84 17.51,14.85 D2.K
$1N17858: length 3.1
  Top Layer w0.254: LED5V.A 35.43,25.11 R11.2
$1N22991: length 3.3
  Top Layer w0.254: LEDOP.A 61.85,15.47 61.85,12.61 R33.2
$1N30175: length 13.6
  Top Layer w0.254: ON/OFF.2 5.21,36.7
  Top Layer w0.762: 2.72,26.92 2.61,27.03 2.61,28 1.65,28.96 1.65,35.18 3.43,36.96 ON/OFF.2
$1N38666: length 3
  Top Layer w0.254: U2.4 19.86,34.72 19.86,34.16
$1N39173: length 3.8
  Top Layer w0.254: C4.1 18.92,42.55 18.13,41.75 U2.1
$1N39467: length 8.5
  Top Layer w0.254: L1.1 27.04,40.13 23.66,40.13 U2.8 23.5,40.26 23.5,41.78 22.73,42.55 C4.2
$1N41387: length 8
  Top Layer w0.254: 10.03,48.26 R7.ADJ 12.61,48.26 R6.2
$1N41664: length 6.5
  Top Layer w0.254: R5.1 27.9,35.22 25.4,37.72 U2.6
$1N41948: length 2.1
  Top Layer w0.254: R5.2 C7.1
$1N42725: length 24.4
  Top Layer w0.254: R7.2 19.22,48.26 R8.1 v1(20.07,44.32) ; v1(25.53,35.69) 24.29,35.69 U2.5
  Bottom Layer w0.254: v1(20.07,44.32) 24.51,44.32 25.78,43.05 25.78,35.94 v1(25.53,35.69)
$1N43649: length 2.7
  Top Layer w0.254: R9.1 32.13,53.85 31.5,54.48 LEDSTEER.A
$1N45499: length 7.8
  Top Layer w0.254: R10.1 21.84,52.7 STEER1.1
$1N56324: length 12
  Top Layer w0.254: R35.1 131.03,44.07 132.33,44.07 133.31,43.09 R14.2 133.31,42.12 132.3,41.12 S1.2 S1.2
$1N56387: length 10.7
  Top Layer w0.254: R36.1 131.03,35.94 132.21,35.94 133.44,34.71 R15.2 133.44,33.61 S2.2 S2.2
$1N56450: length 10.7
  Top Layer w0.254: R37.1 131.03,28.45 132.46,28.45 133.56,27.34 R16.2 133.56,26.37 S3.2 S3.2
$1N56513: length 10.2
  Top Layer w0.254: R38.1 130.9,20.95 132.29,20.95 R17.2 133.31,18.36 S4.2 S4.2
$1N101481: length 7.4
  Top Layer w0.254: B1.1 128.1,50.67 R22.2
$1N101720: length 9
  Top Layer w0.254: B1.2 125.94,58.43 Q2.3
$1N102266: length 4.2
  Top Layer w0.254: v1(117.1,56.13) Q2.1 119.45,54.38 R23.2
$1N103802: length 9.7
  Top Layer w0.254: 电机信号1.5 35.75,56.13 v1(36.45,56.13) ; R25.1 44.11,55.25 v1(42.67,55.25)
  Bottom Layer w0.254: v1(36.45,56.13) 37.34,55.25 v1(42.67,55.25)
$1N103804: length 4.4
  Top Layer w0.254: R26.1 42.54,57.91 41.21,56.58 电机信号1.1
$1N103886: length 13
  Top Layer w0.254: v1(42.8,52.83) 44.15,52.83 R27.1 ; v1(35.81,49.28) 35.31,49.78 电机信号1.6
  Bottom Layer w0.254: v1(35.81,49.28) 39.24,49.28 v1(42.8,52.83)
$1N103888: length 4.8
  Top Layer w0.254: 电机信号1.2 41.08,51.88 42.54,50.42 44.36,50.42 R28.1
$1N112323: length 5.7
  Top Layer w0.254: 53.21,40.26 电磁接口2.6
$1N112483: length 5.7
  Top Layer w0.254: 48.13,40.26 电磁接口2.4
$1N112563: length 5.7
  Top Layer w0.254: 45.59,40.26 电磁接口2.3
$1N112723: length 5.7
  Top Layer w0.254: 电磁接口2.1 40.51,40.26

## Copper pours and planes (outline as drawn; the poured copper is in the pictures)
GND5V on Bottom Layer: -85.34,-62.74 52.58,-62.74 52.58,-126.24 -85.34,-126.24
GNDBAT on Top Layer: 10.92,-79.5 148.21,-79.5 148.21,-143.38 10.92,-143.38
